# EAGLE design full_board (EAGLE 9.5.2)
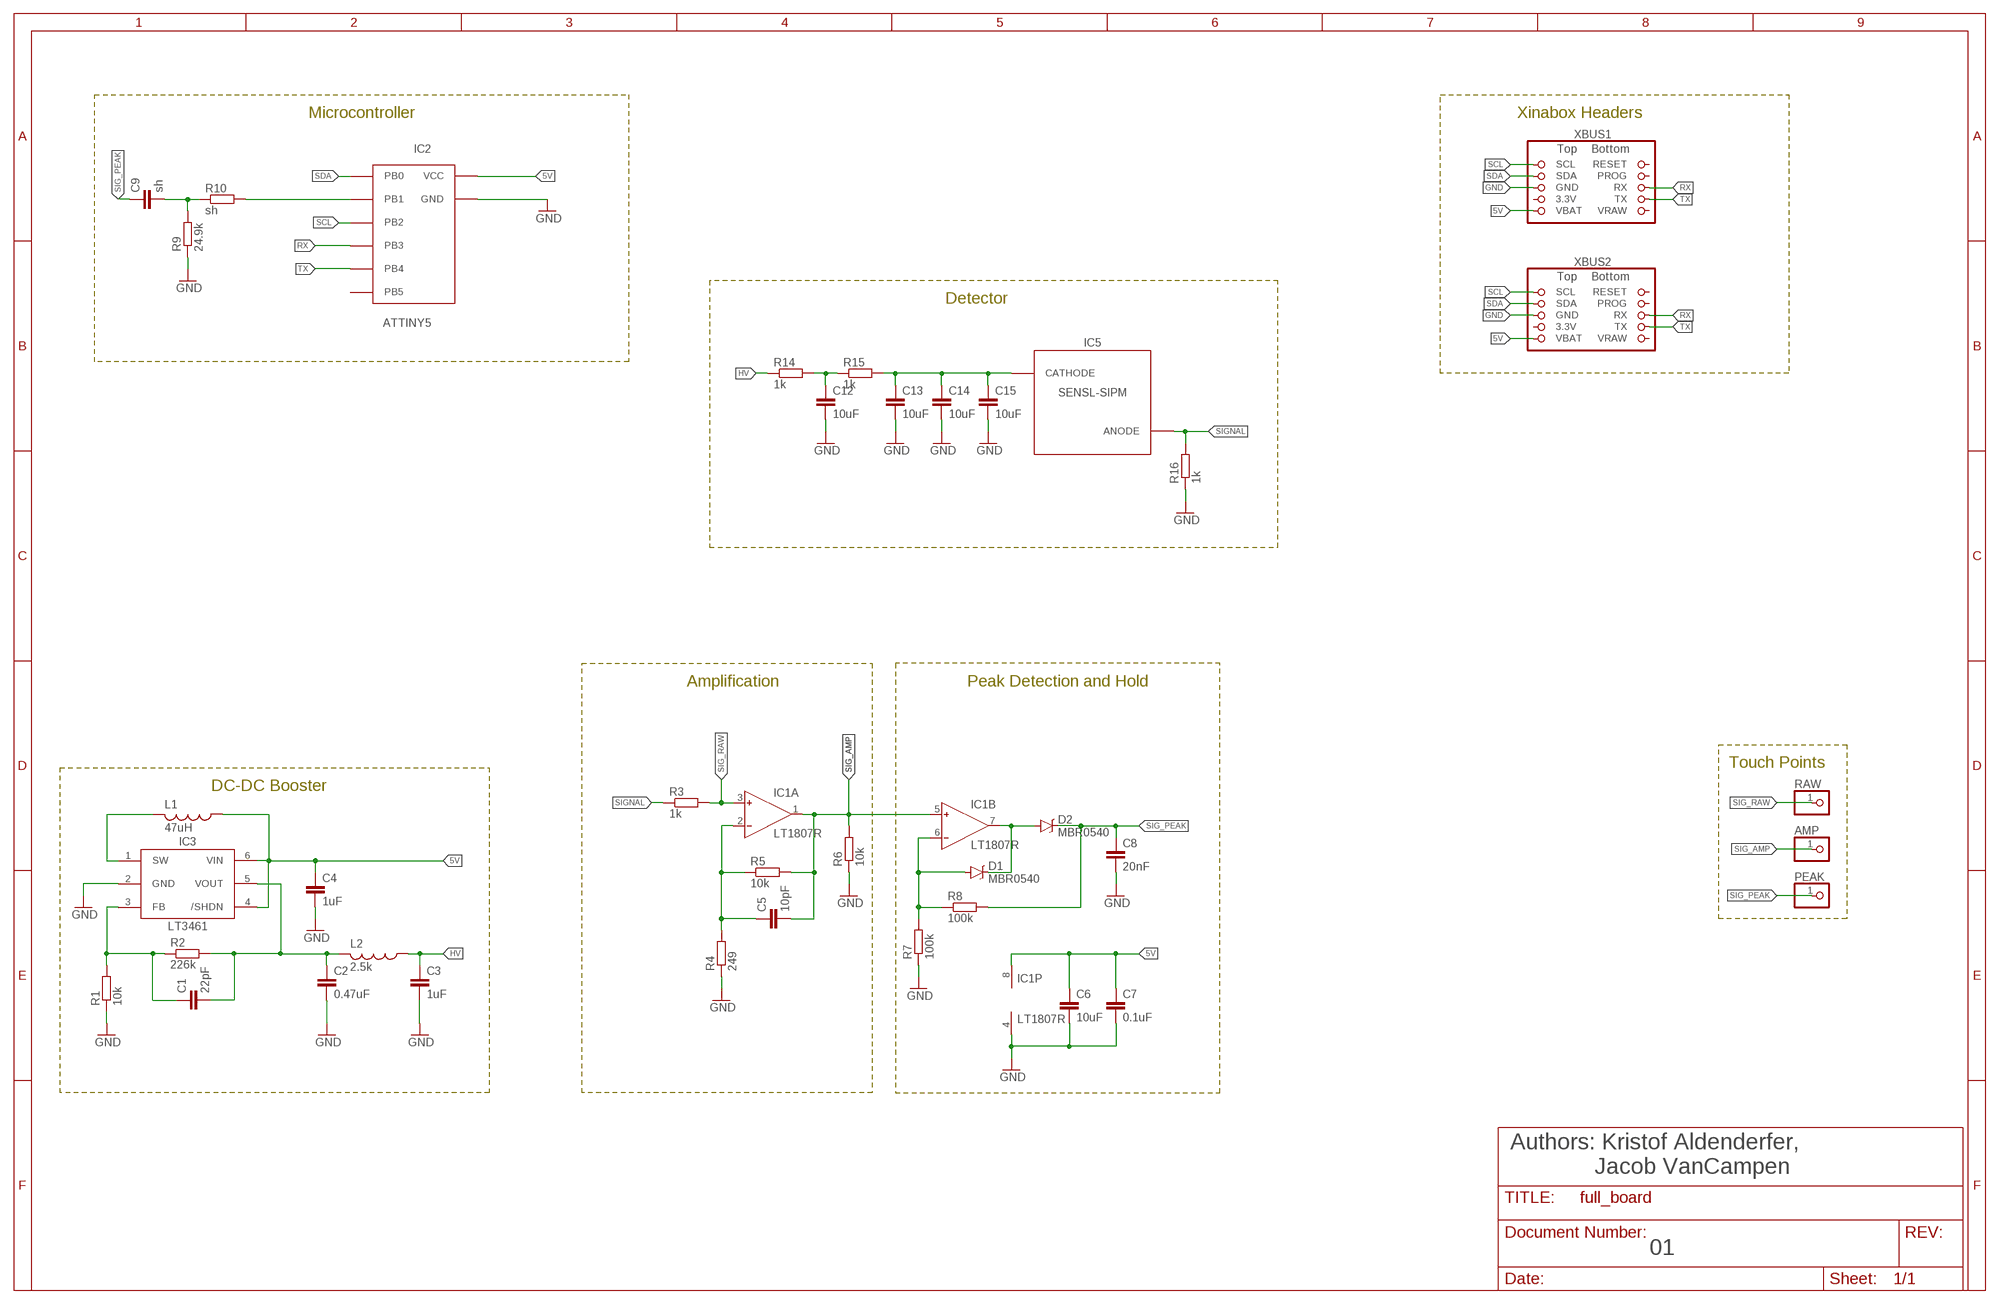
[diagram p0: schematic, sheet 1]

## Parts
AMP  PINHD-1X1  [1X01]
C1  22pF  C-EUC0805K  [C0805K]
C2  0.47uF  C-EUC0805K  [C0805K]
C3  1uF  C-EUC0805K  [C0805K]
C4  1uF  C-EUC0805K  [C0805K]
C5  10pF  C-EUC0805K  [C0805K]
C6  10uF  C-EUC0805K  [C0805K]
C7  0.1uF  C-EUC0805K  [C0805K]
C8  20nF  C-EUC0805K  [C0805K]
C9  sh  C-EUC0805K  [C0805K]
C12  10uF  C-EUC0805K  [C0805K]
C13  10uF  C-EUC0805K  [C0805K]
C14  10uF  C-EUC0805K  [C0805K]
C15  10uF  C-EUC0805K  [C0805K]
D1  MBR0540  DIODE-SCHOTTKY-B340A  [SMA-DIODE]
D2  MBR0540  DIODE-SCHOTTKY-B340A  [SMA-DIODE]
IC1  LT1807R  [SO8]
IC2  ATTINY5  [PDIP8]
IC3  LT3461  [SOT23-6]
IC5  SENSL-SIPM  [MICROFC-60035]
L1  47uH  L-USL3225M  [L3225M]
L2  2.5k  L-USL2012C  [L2012C]
PEAK  PINHD-1X1  [1X01]
R1  10k  R-EU_M0805  [M0805]
R2  226k  R-EU_M0805  [M0805]
R3  1k  R-EU_M0805  [M0805]
R4  249  R-EU_M0805  [M0805]
R5  10k  R-EU_M0805  [M0805]
R6  10k  R-EU_M0805  [M0805]
R7  100k  R-EU_M0805  [M0805]
R8  100k  R-EU_M0805  [M0805]
R9  24.9k  R-EU_M0805  [M0805]
R10  sh  R-EU_M0805  [M0805]
R14  1k  R-EU_M0805  [M0805]
R15  1k  R-EU_M0805  [M0805]
R16  1k  R-EU_M0805  [M0805]
RAW  PINHD-1X1  [1X01]
XBUS1  XINABOX-XBUS  [XBUS_2X05_PAD]
XBUS2  XINABOX-XBUS  [XBUS_2X05_PAD]

## Nets
5V: C4.1 C6.1 C7.1 IC1.8(P:V+) IC2.P8(VCC) IC3.4(/SHDN) IC3.6(VIN) L1.1 XBUS1.5(VBAT) XBUS2.5(VBAT)
GND: C2.2 C3.2 C4.2 C6.2 C7.2 C8.2 C12.2 C13.2 C14.2 C15.2 IC1.4(P:V-) IC2.P4(GND) IC3.2(GND) R1.1 R4.1 R6.1 R7.1 R9.1 R16.1 XBUS1.3(GND) XBUS2.3(GND)
HV: C3.1 L2.1 R14.1
N$1: IC3.1(SW) L1.2
N$2: D1.C D2.A IC1.7(B:OUT)
N$3: C1.1 IC3.3(FB) R1.2 R2.1
N$4: D1.A IC1.6(B:IN-) R7.2 R8.1
N$6: C13.1 C14.1 C15.1 IC5.CATHODE R15.2
N$7: C1.2 C2.1 IC3.5(VOUT) L2.2 R2.2
N$8: C5.1 IC1.2(A:IN-) R4.2 R5.1
N$9: C9.2 R9.2 R10.1
N$10: IC2.P6(PB1) R10.2
N$11: C12.1 R14.2 R15.1
RX: IC2.P2(PB3) XBUS1.8(RX) XBUS2.8(RX)
SCL: IC2.P7(PB2) XBUS1.1(SCL) XBUS2.1(SCL)
SDA: IC2.P5(PB0) XBUS1.2(SDA) XBUS2.2(SDA)
SIG_AMP: AMP.1 C5.2 IC1.1(A:OUT) IC1.5(B:IN+) R5.2 R6.2
SIG_PEAK: C8.1 C9.1 D2.C PEAK.1 R8.2
SIG_RAW: IC1.3(A:IN+) R3.2 RAW.1
SIGNAL: IC5.ANODE R3.1 R16.2
TX: IC2.P3(PB4) XBUS1.9(TX) XBUS2.9(TX)
Unconnected: IC2.P1(PB5) XBUS1.4(3.3V) XBUS1.6(RESET) XBUS1.7(PROG) XBUS1.10(VRAW) XBUS2.4(3.3V) XBUS2.6(RESET) XBUS2.7(PROG) XBUS2.10(VRAW)

## Notes on the sheet
- Microcontroller | Xinabox Headers
- Detector
- Amplification | Peak Detection and Hold
- Touch Points
- DC-DC Booster
- Authors: Kristof Aldenderfer,
               Jacob VanCampen
- 01

## Library data of the parts
AMP PEAK RAW = pinhead:PINHD-1X1: PIN HEADER
C1-C9 C12-C15 = rcl:C-EU: CAPACITOR, European symbol; SPICEPREFIX: C
D1 D2 = SparkFun-DiscreteSemi:DIODE-SCHOTTKY: Schottky diodes in SFE's production catalog BAT20J 1A 23V 0.62Vf RB751 120mA 40V 0.37Vf PMEG4005EJ 0.5A 40V 0.42Vf MBRA140 1A 40V 0.5Vf B340A 3A 40V SMA; PROD_ID: DIO-09886; VALUE: B340A
IC1 = Personal:LT1807: Dual Precision, 500 ns Settling, BiFET Op Amp Source: http://www.analog.com/static/imported-files/data_sheets/AD746.pdf; MF: ALTERA CORPORATION; MPN: AD746JRZ; OC_FARNELL: 1423876; OC_NEWARK: 59K4845
IC2 = Personal:ATTINY*5
IC3 = Personal:LT3461: LT3426 1.2MHz, 2A boost converter in SOT-23 http://www.linear.com/pc/productDetail.jsp?navId=H0,C1,C1003,C1042,C1031,C1061,P8430 (Linear website)
IC5 = Personal:SENSL-SIPM
L1 L2 = rcl:L-US: INDUCTOR, American symbol; SPICEPREFIX: L
R1-R10 R14-R16 = rcl:R-EU_: RESISTOR, European symbol; SPICEPREFIX: R
XBUS1 XBUS2 = Personal:XINABOX-XBUS: PIN HEADER

## Board
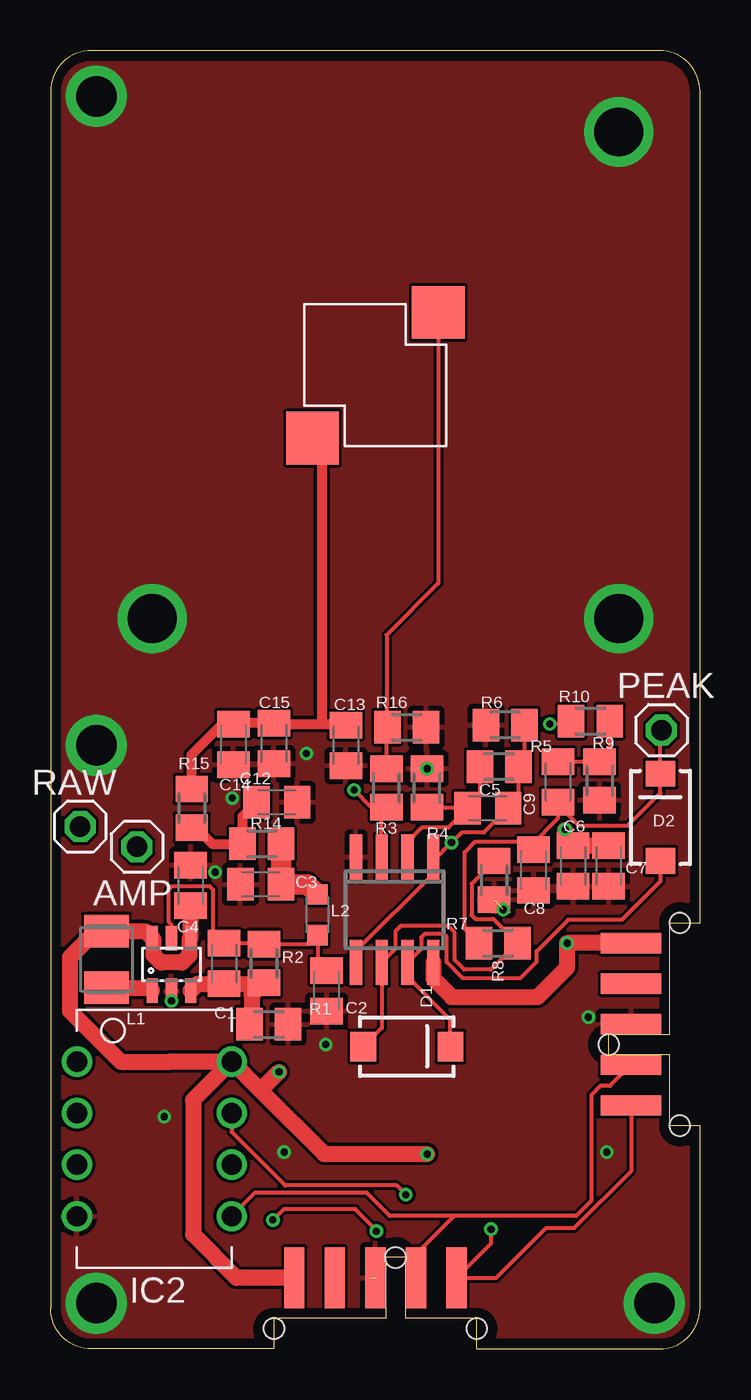
[diagram p1: board, top side]
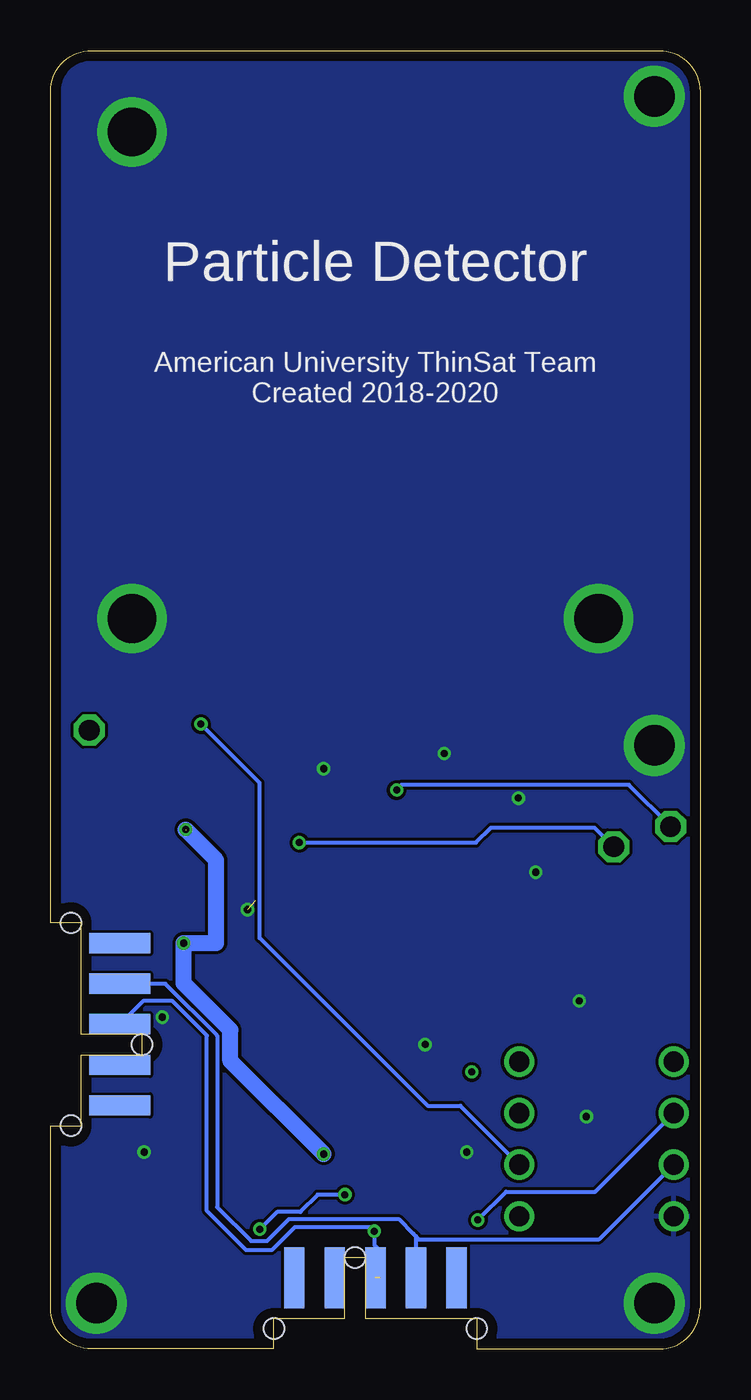
[diagram p2: board, bottom side, seen from below]

Size 32 x 64 mm. Coordinates in mm from the lower left corner, seen from the top.
Outline: 11,0 2,0 arc-90 0,2 0,62 arc-90 2,64 30,64 arc-90 32,62 32,21 30.5,21 30.5,15.5 27.5,15.5 27.5,14.5 30.5,14.5 30.5,11 32,11 32,2 arc-90 30,0 21,0 21,1.5 17.5,1.5 17.5,4.5 16.5,4.5 16.5,1.5 11,1.5 11,0
Copper layers (1*16): Top 0.035mm / dielectric 1.6mm / Bottom 0.035mm
Design rules "Elecrow_2-layer_PCB_eagle_rule": minimum track width 6mil, minimum drill 12mil, track to track 6mil, track to pad 8mil, pad to pad 12mil, via to via 12mil, smd to smd 0mil, copper to edge 20mil, drill to drill 10mil, minimum pad ring 6mil, minimum via ring 6mil, stop-mask expansion 0mil, vias tented up to drill 100mil, thermal gap 10mil
Holes 1 mm at 21,1 11,1 17,4.5 31,11 31,21 27.5,15
tKeepout: area 0,32 to 32,64
bKeepout: area 0,27.2 to 5,32.2; area 0,59.2 to 5,64.2; area 0,27.2 to 2.5,32.2; area 0,59.2 to 2.5,64.2

### Footprints (pad centres in the part's own frame; a part is rotated, then mirrored left to right if it is on the bottom)
1X01 = drill 1.016 octagon: 1 0,0
C0805K = smd 1.3 x 1.6: 1 -1,0; 2 1,0
SMA-DIODE = smd 1.27 x 1.47: A -2.15,0; C 2.15,0
SO8 = smd 0.6 x 2.2: 1 -1.905,-2.6; 2 -0.635,-2.6; 3 0.635,-2.6; 4 1.905,-2.6; 5 1.905,2.6; 6 0.635,2.6; 7 -0.635,2.6; 8 -1.905,2.6
PDIP8 = drill 0.991: P1 -3.556,3.81; P2 -3.556,1.27; P3 -3.556,-1.27; P4 -3.556,-3.81; P5 4.064,-3.81; P6 4.064,-1.27; P7 4.064,1.27; P8 4.064,3.81
SOT23-6 = smd 0.55 x 1.2: 1 -0.95,-1.3; 2 0,-1.3; 3 0.95,-1.3; 4 0.95,1.3; 5 0,1.3; 6 -0.95,1.3
MICROFC-60035 = smd 2.6 x 2.6: ANODE -3.1,-3.1; CATHODE 3.1,3.1
L3225M = smd 1.6 x 2.2: 1 -1.4,0; 2 1.4,0
L2012C = smd 1 x 1: 1 -1,0; 2 1,0
M0805 = smd 1.3 x 1.6: 1 -0.95,0; 2 0.95,0
XBUS_2X05_PAD = smd 1 x 3: 1 4,0; 2 2,0; 3 0,0; 4 -2,0; 5 -4,0 | smd 1 x 3 bottom: 6 4,0; 7 2,0; 8 0,0; 9 -2,0; 10 -4,0

### Placement (x,y rotation side)
AMP  4.25,24.75 0 top
C1  8.55,19 90 top
C2  13.6,17.65 270 top
C3  10.35,22.9 180 top
C4  6.9,22.85 90 top
C5  21.55,26.65 0 top
C6  25.75,23.8 270 top
C7  27.5,23.8 270 top
C8  23.8,23.6 270 top
C9  25,27.95 90 top
C12  11.15,26.95 0 top
C13  14.55,29.75 270 top
C14  9,29.8 270 top
C15  11,29.85 270 top
D1  17.55,14.9 0 top
D2  30.05,26.2 90 top
IC1  16.95,21.65 180 top
IC2  4.85,10.35 0 top
IC3  5.95,18.95 0 top
IC5  16,48 180 top
L1  2.75,19.2 270 top
L2  13.15,21.4 270 top
PEAK  30.1,30.5 0 top
R1  10.75,16 180 top
R2  10.5,19 90 top
R3  16.55,27.65 270 top
R4  18.55,27.65 270 top
R5  22.1,28.7 0 top
R6  22.4,30.75 0 top
R7  21.85,23.1 90 top
R8  22.05,20 180 top
R9  27.05,28 90 top
R10  26.6,30.95 180 top
R14  10.4,24.9 180 top
R15  6.95,26.65 90 top
R16  17.55,30.65 180 top
RAW  1.45,25.75 0 top
XBUS1  16,3.5 0 top
XBUS2  28.6,16 270 top

### Tracks (layer width: path | path; a pad name or v marks a point on that pad's centre or on a via)
5V  (via drill 0.35)  (1 unrouted)
  Top 0.8: XBUS2.5 v25.45,20 25.45,18.8 24,17.35 19.76,17.35 18.86,18.25 IC1.8 | C7.1 C6.1 25.35,25.2 25.35,25.55 25.34,25.56 | 8.94,14.16 IC2.P8 | IC2.P8 7.02,12.26 7.02,5.63 9.15,3.5 XBUS1.5 | C4.1 IC3.4 6.83,20.18 6.83,19.4 6.47,19.05 5.42,19.05 5.07,19.4 5.07,20.18 IC3.6 4.65,20.6 L1.1 2.25,20.6 0.95,19.3 0.95,16.65 3.45,14.15 5.88,14.15 5.89,14.16 IC2.P8 | 10.34,12.74 13.47,9.6 v18.55,9.6 | 10.34,12.74 IC2.P8 | 8.79,14.29 IC2.P8 | v11.25,13.65 10.34,12.74
  Bottom 0.8: v18.55,9.6 23.14,14.19 23.14,15.72 25.45,18.02 v25.45,20 23.85,20 23.85,24.1 v25.35,25.6
GND  (via drill 0.35, 2, 2 pad 3, 2.4, 2.4 pad 3)  (1 unrouted)
  Top 1: 21.9,22.1 R7.1
  other vias: 29.75,2.25 2.25,2.25 28,60 5,36 28,36 2.25,61.75 2.25,29.75 27.4,9.7 26.5,16.35 18.55,28.6 12.6,29.35 8.95,27.15 13.55,15 5.95,17.15 8.1,23.5 11.5,9.7 5.6,11.45 22.3,21.65
  pour Top: 33,65 33,-1 -1,-1 -1,65
  pour Bottom: 34,66 34,-2 -2,-2 -2,66
HV
  Top 1: R14.1 C3.1 12.65,22.9 L2.1
N$1
  Top 0.8: L1.2 4.85,17.8 IC3.1
N$2
  Top 0.2: D2.A 30.05,23.04 28.16,21.15 25.5,21.15 23.95,19.6 23.95,19.07 23.18,18.3 20.27,18.3 19.51,19.06 19.51,20.33 19.38,20.45 18.43,20.45 18.25,20.28 18.25,19.72 IC1.7 17.59,18.34 19.7,16.23 D1.C
N$3
  Top 0.2: 10.45,18 R2.1
  Top 0.8: IC3.3 7.25,18 C1.1 10.45,18 | R2.1 9.9,17.45 9.9,16.08 R1.2
N$4
  Top 0.2: 21.65,24.05 R7.2 21.85,24.03 20.75,22.93 20.75,21.37 20.92,21.2 21.8,21.2 R8.1 21.7,18.7 20.37,18.7 19.91,19.16 19.91,20.53 19.58,20.85 17.26,20.85 16.98,20.58 16.98,19.72 IC1.6 16.32,15.81 D1.A
N$6
  Top 0.2: IC5.CATHODE 13.4,44.4 | 6.95,27.75 R15.2
  Top 0.5: C15.1 10.6,30.85 | IC5.CATHODE 13.35,44.45 13.35,30.8 | 13.35,30.8 11.05,30.8 C15.1 | 13.35,30.8 14.5,30.8 C13.1 | C15.1 9.05,30.85 C14.1 8.45,30.8 6.95,29.3 R15.2
N$7
  Top 0.2: C2.1 13.45,18.8 13.47,18.88 13.15,19.2 L2.2 12.7,19.95 R2.2 10.45,20 C1.2 8,20.55 8,22.63 7.83,22.8 5.97,22.8 5.8,22.63 5.8,21.07 5.95,20.92 IC3.5
N$8
  Top 0.2: R4.2 20.5,26.7 | 20.5,26.7 C5.1 19.6,25.7 18.3,25.7 17.59,24.99 IC1.2 | R5.1 21.15,27.35 20.5,26.7
N$9
  Top 0.2: R10.1 27.55,29.45 R9.2 C9.2
N$10  (via drill 0.35)
  Top 0.2: R10.2 25.5,30.8 v24.6,30.8
  Bottom 0.2: IC2.P6 11.81,11.98 13.43,11.98 21.7,20.25 21.7,27.9 v24.6,30.8
N$11
  Top 0.2: R14.2 9.6,25.05
  Top 0.5: R15.1 7.15,25.7 7.95,24.9 R14.2 9.45,26.25 C12.1
RX  (via drill 0.35)  (1 unrouted)
  Top 0.2: v16.05,5.8 16.05,5.85 15.01,6.89 12.97,6.89 12.96,6.9 11.5,6.9 v10.95,6.35
  Bottom 0.2: XBUS2.8 27.45,17.15 26,17.15 24.3,15.45 24.3,6.79 22.37,4.86 21.11,4.86 19.97,6 16.25,6 v16.05,5.8 16.05,5.12 15.89,4.96 15.89,3.5 15.75,3.5 | IC2.P2 5.16,7.75 9.55,7.75 v10.95,6.35
SCL  (via drill 0.35)
  Top 0.2: XBUS2.1 28.6,8.75 25.81,5.96 24.41,5.96 21.95,3.5 XBUS1.1 21.7,5.2 v21.7,5.9 | IC2.P7 8.91,10.69 11.55,8.05 17.05,8.05 v17.5,7.6
  Bottom 0.2: v17.5,7.6 18.85,7.6 19.7,6.75 20.85,6.75 v21.7,5.9
SDA
  Top 0.2: 27.19,14.25 28.35,14.25 XBUS2.2 27.55,12.95 27.09,12.95 26.65,12.5 26.65,7.3 25.9,6.55 19.9,6.55 | XBUS1.2 18,4.65 19.9,6.55 | IC2.P5 10.06,7.69 15.56,7.69 16.7,6.55 19.9,6.55
SIG_AMP  (via drill 0.35)
  Top 0.2: R6.2 23.35,29 R5.2 23.05,27.15 C5.2 21.35,25.45 20.25,25.45 v19.75,24.96 18.86,24.06 | IC1.5 15.04,19.61 18.86,23.42 18.86,24.06 | 18.86,24.06 IC1.1
  Bottom 0.2: AMP.1 5.2,25.7 10.3,25.7 11.04,24.96 v19.75,24.96
SIG_PEAK
  Top 0.2: PEAK.1 30.05,30.45 D2.C 30.05,27.4 28.45,25.8 26.02,25.8 25,26.82 C9.1 25,26.15 23.62,24.77 C8.1 23.8,24.85 23.55,25.1 23.45,25 20.92,25 20.39,24.47 20.39,20.71 R8.2
SIG_RAW  (via drill 0.35)
  Top 0.2: v14.95,27.55 15.8,26.7 R3.2 16.27,26.41 16.27,24.3 IC1.3
  Bottom 0.2: RAW.1 3.5,27.8 14.7,27.8 v14.95,27.55
SIGNAL
  Top 0.2: IC5.ANODE 19.1,37.75 16.55,35.2 16.55,30.7 R16.2 16.55,30.6 R3.1
TX
  Bottom 0.2: XBUS2.9 26.35,18 23.8,15.45 23.8,6.99 22.12,5.31 21.34,5.31 20.25,6.4 14.85,6.4 14.12,5.67 14,5.55 | 14,5.55 XBUS1.9 | 14,5.55 13.82,5.38 5,5.38 IC2.P3

### Text on the board
bNames: Particle Detector | American University ThinSat Team / Created 2018-2020